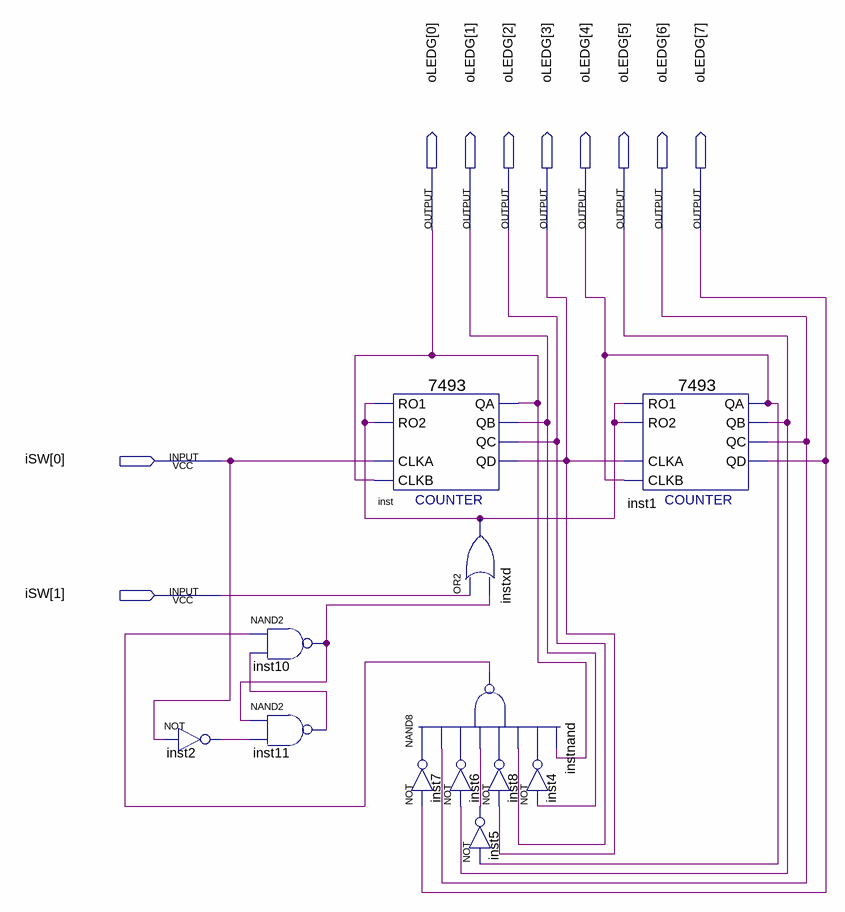
[diagram p0: schematic sheet]
// Quartus schematic Cwiczenie3_1.bdf as structural Verilog: 12 symbols, 10 pins
module Cwiczenie3_1 (
  input  [1:0] iSW,
  output [7:0] oLEDG
);

  wire inst2_out, inst4_out, inst5_out, inst6_out, inst7_out, inst8_out, inst10_out, inst11_out,
       instnand_out, instxd_out;

  not inst2 (inst2_out, iSW[0]);
  nand inst10 (inst10_out, instnand_out, inst11_out);
  nand inst11 (inst11_out, inst10_out, inst2_out);
  \7493  inst (
    .RO1(instxd_out), .RO2(instxd_out), .CLKA(iSW[0]), .CLKB(oLEDG[0]), .QC(oLEDG[2]), .QB(oLEDG[1]),
    .QA(oLEDG[0]), .QD(oLEDG[3]));
  nand instnand (instnand_out, inst7_out, oLEDG[6], inst6_out, inst5_out, inst8_out, oLEDG[2], inst4_out, oLEDG[0]);
  not inst7 (inst7_out, oLEDG[7]);
  or instxd (instxd_out, iSW[1], inst10_out);
  not inst6 (inst6_out, oLEDG[5]);
  not inst8 (inst8_out, oLEDG[3]);
  not inst5 (inst5_out, oLEDG[4]);
  not inst4 (inst4_out, oLEDG[1]);
  \7493  inst1 (
    .RO1(instxd_out), .RO2(instxd_out), .CLKA(oLEDG[3]), .CLKB(oLEDG[4]), .QC(oLEDG[6]), .QB(oLEDG[5]),
    .QA(oLEDG[4]), .QD(oLEDG[7]));
endmodule
